# EAGLE design tetris (EAGLE 6.2)
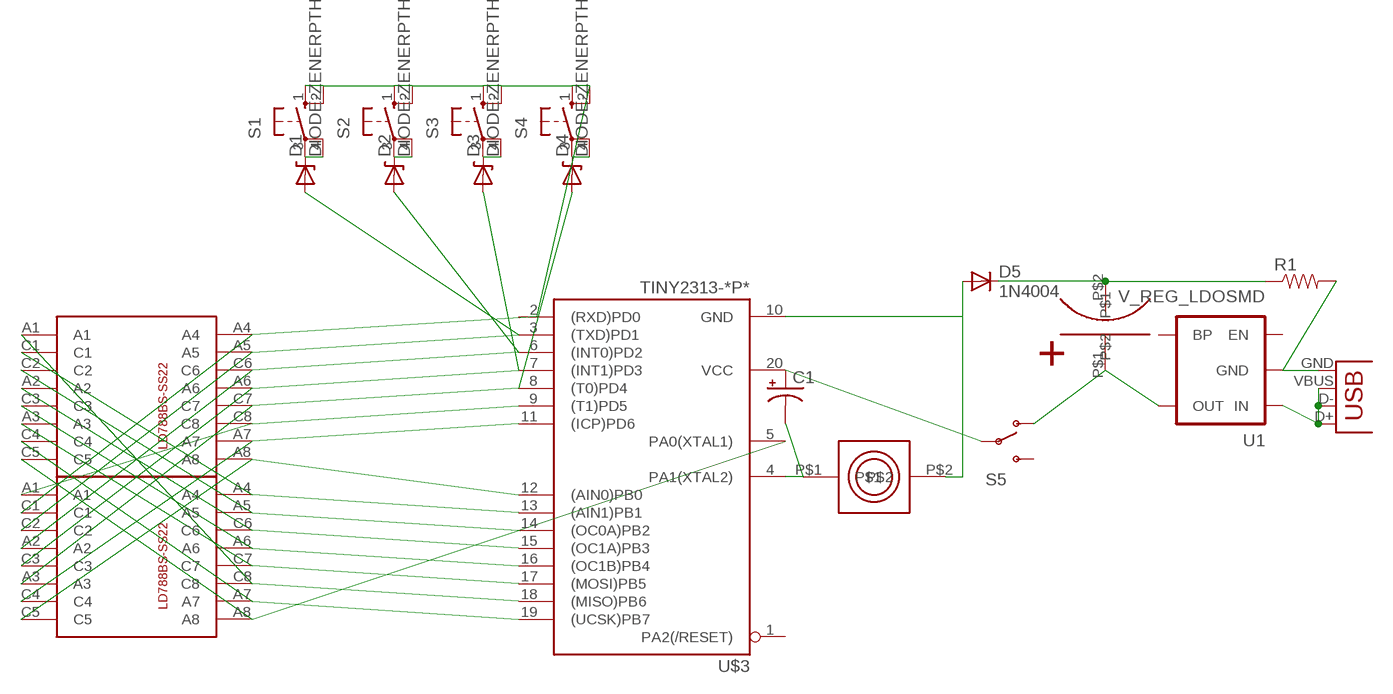
[diagram p0: schematic, sheet 1]

## Parts
C1  CAP_POLPTH1  [CPOL-RADIAL-100UF-25V]
D1  DIODE-ZENERPTH  [DIODE-ZENER]
D2  DIODE-ZENERPTH  [DIODE-ZENER]
D3  DIODE-ZENERPTH  [DIODE-ZENER]
D4  DIODE-ZENERPTH  [DIODE-ZENER]
D5  1N4004  [DO41-10]
R1  RESISTORPTH1  [AXIAL-0.3]
S1  10-XX  [B3F-10XX]
S2  10-XX  [B3F-10XX]
S3  10-XX  [B3F-10XX]
S4  10-XX  [B3F-10XX]
S5  SWITCH-SPSTSMD2  [SWITCH-SPDT-SMD]
U1  V_REG_LDOSMD  [SOT23-5]
U$1  LD788BS-SS22  [LD788BS-SS22]
U$2  LD788BS-SS22  [LD788BS-SS22]
U$3  TINY2313-*P*  [DIL20]
U$4  I-80450RF  [ISK4.1K_I-80450RF_I2G]
U$5  NICHICON_12F  [NICHICON_10X30]
X1  USB-MICROB  [USB-MICROB]

## Nets
N$1: U$1.A4 U$2.C1 U$3.13((AIN1)PB1)
N$2: U$1.A5 U$2.C2 U$3.14((OC0A)PB2)
N$3: U$1.C6 U$2.A2 U$3.15((OC1A)PB3)
N$4: U$1.A6 U$2.C3 U$3.16((OC1B)PB4)
N$5: U$1.C7 U$2.A3 U$3.17((MOSI)PB5)
N$6: U$1.A7 U$2.C4 U$3.19((UCSK)PB7)
N$7: U$1.A8 U$2.C5 U$3.5(PA0(XTAL1))
N$8: U$1.C8 U$2.A1 U$3.18((MISO)PB6)
N$9: D5.C R1.P$1 U$5.P$2
N$10: D1.P$2(A) U$1.C2 U$2.A5 U$3.3((TXD)PD1)
N$11: D2.P$2(A) U$1.A2 U$2.C6 U$3.6((INT0)PD2)
N$12: D3.P$2(A) U$1.C3 U$2.A6 U$3.7((INT1)PD3)
N$13: D4.P$2(A) U$1.A3 U$2.C7 U$3.8((T0)PD4)
N$14: U$1.A1 U$2.C8 U$3.9((T1)PD5)
N$15: U$1.C4 U$2.A7 U$3.11((ICP)PD6)
N$16: U$1.C5 U$2.A8 U$3.12((AIN0)PB0)
N$17: C1.2(-) U$3.4(PA1(XTAL2)) U$4.P$1
N$18: D5.A U$3.10(GND) U$4.P$2
N$19: S5.1(O) U1.5(OUT) U$5.P$1
N$20: D1.P$1(C) S1.3(P) S1.4(P1)
N$21: D2.P$1(C) S2.3(P) S2.4(P1)
N$22: D3.P$1(C) S3.3(P) S3.4(P1)
N$23: D4.P$1(C) S4.3(P) S4.4(P1)
N$24: R1.P$2 U1.2(GND) X1.GND
N$25: U1.1(IN) X1.D+ X1.D- X1.VBUS
N$26: C1.1(+) S5.2(P) U$3.20(VCC)
N$27: S1.1(S) S1.2(S1) S2.1(S) S2.2(S1) S3.1(S) S3.2(S1) S4.1(S) S4.2(S1) U$1.C1 U$2.A4
Unconnected: S5.3(S) U1.3(EN) U1.4(BP) U$3.1(PA2(/RESET)) U$3.2((RXD)PD0)

## Library data of the parts
C1 = SparkFun:CAP_POL: Capacitor Polarized These are standard SMD and PTH capacitors. Normally 10uF, 47uF, and 100uF in electrolytic and tantalum varieties. Always verify the external diameter of the through hole cap, it varies with capacity, voltage, and manufacturer. The EIA devices should be standard.
D1-D4 = SparkFun:DIODE-ZENER: Zener Diode Production Part - 8199 3.4V Zener Voltage
D5 = adafruit:1N4004: DIODE General purpose 1N400x type rectifier (With bigger pads) http://www.ladyada.net/library/pcb/eaglelibrary.html
R1 = SparkFun:RESISTOR: Resistor Basic schematic elements and footprints for 0603, 1206, and PTH 1/10th watt (small) resistors.
S1-S4 = switch-omron:10-XX: OMRON SWITCH; MPN: B3F-1000; OC_FARNELL: 176432; OC_NEWARK: 36M3542
S5 = SparkFun:SWITCH-SPST: SPST Switch Simple slide switch. Spark Fun Electronics SKU : COM-00102
U1 = SparkFun:V_REG_LDO: Voltage Regulator LDO Standard 150mA LDO voltage regulator in SOT-23 layout. Micrel part MIC5205. BP (by-pass) pin is used to lower output noise with 470pF cap.
U$1 U$2 = mrule:LD788BS-SS22
U$3 = avr-6:TINY2313*: Atmel Tiny2313 2K Flash, 128 bytes EEPROM, 128 bytes RAM
U$4 = mrule:I-80450RF
U$5 = mrule:NICHICON_12F
X1 = SparkFun:USB: USB Connectors USB-B-PTH is fully proven SKU : PRT-00139 USB-miniB is fully proven SKU : PRT-00587 USB-A-PCB is untested. USB-A-H is throughly reviewed, but untested. Spark Fun Electronics SKU : PRT-00437 USB-B-SMT is throughly reviewed, but untested. Needs silkscreen touching up. USB-A-S has not been used/tested USB-MB-H has not been used/tested

## Board
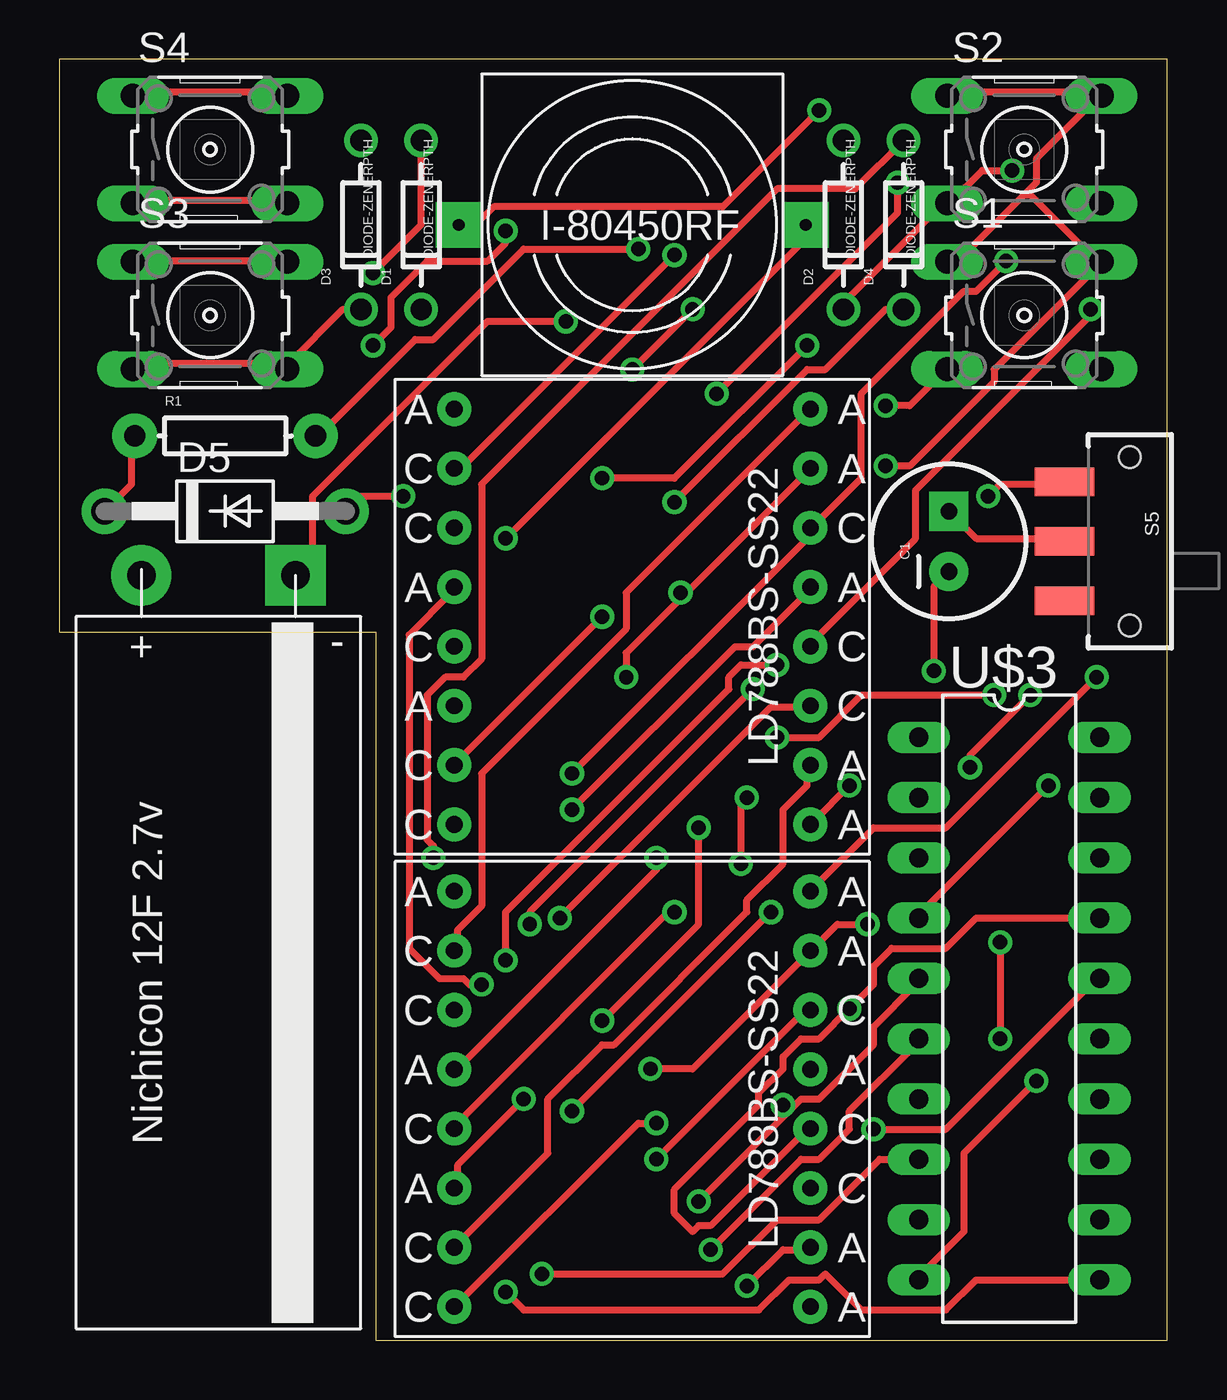
[diagram p1: board, top side]
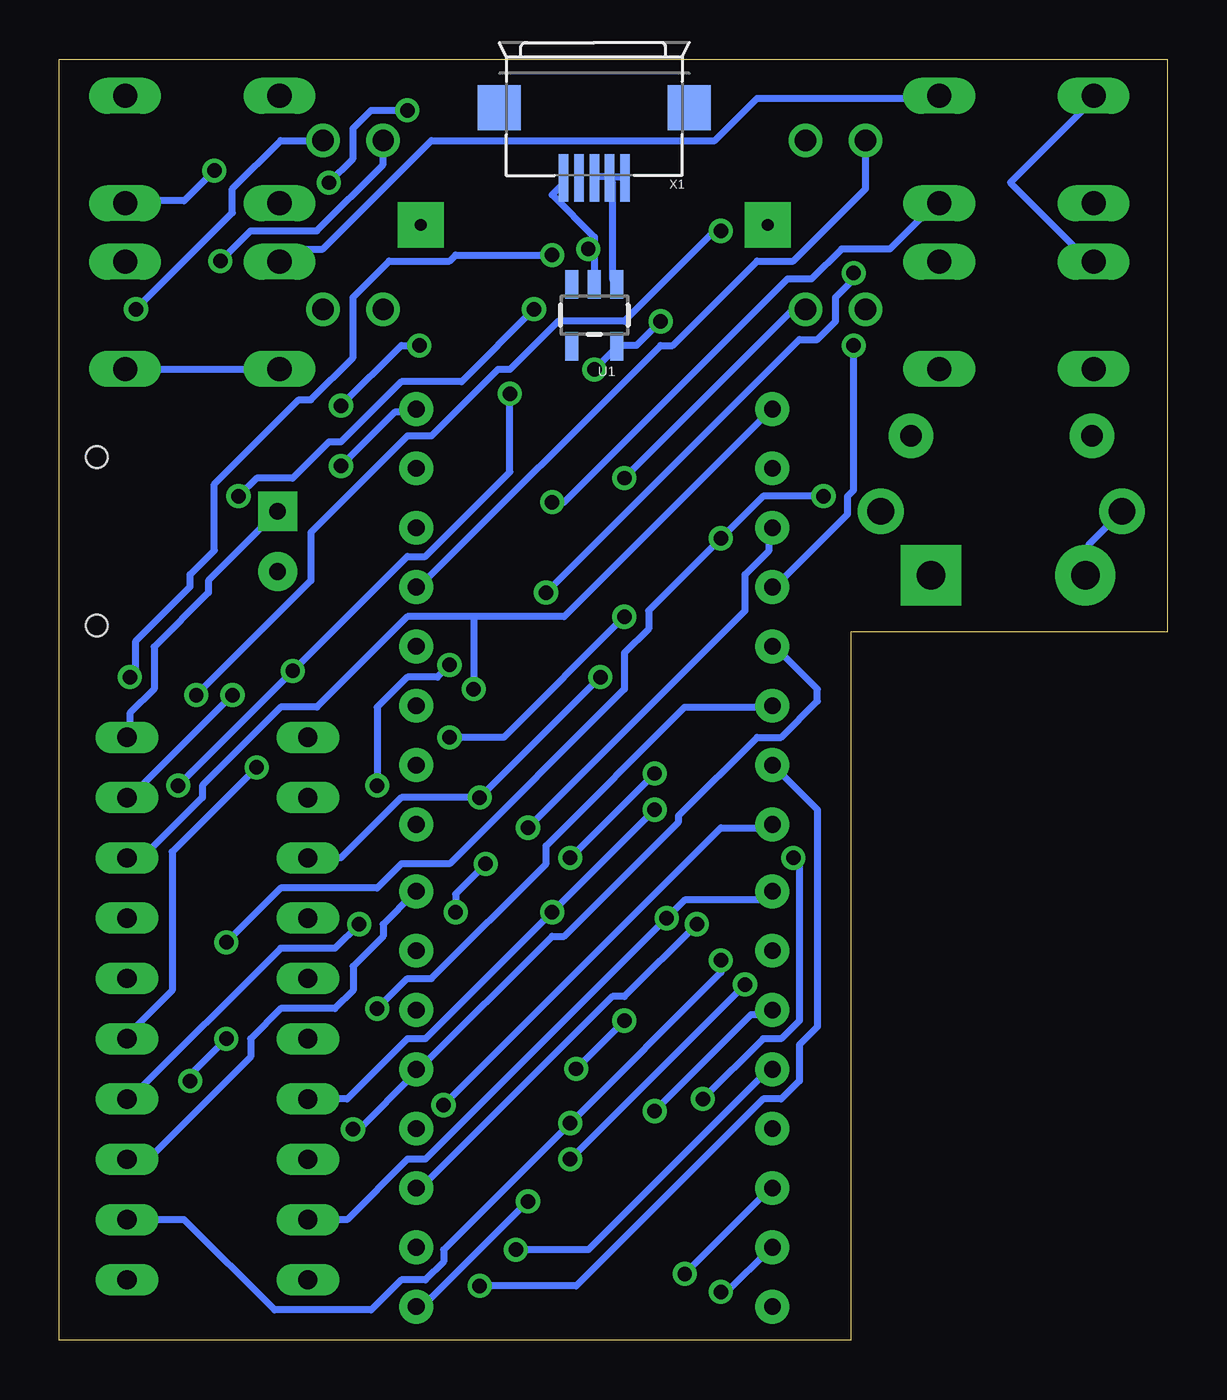
[diagram p2: board, bottom side, seen from below]

Size 46.66 x 53.97 mm. Coordinates in mm from the lower left corner, seen from the top.
Outline: 0,29.84 13.34,29.84 13.34,0 46.66,0 46.66,53.97 0,53.97 0,29.84
Copper layers (1*16): Top 0.035mm / dielectric 1.5mm / Bottom 0.035mm
Design rules: minimum track width 12mil, minimum drill 24mil, track to track 10mil, track to pad 10mil, pad to pad 10mil, via to via 10mil, smd to smd 8mil, copper to edge 40mil, drill to drill 8mil, minimum pad ring 10mil, minimum via ring 8mil, stop-mask expansion 4mil, vias tented up to drill 0mil, thermal gap 10mil

### Footprints (pad centres in the part's own frame; a part is rotated, then mirrored left to right if it is on the bottom)
CPOL-RADIAL-100UF-25V = drill 0.7 pad 1.651 square: 1 1.27,0 | drill 0.7 pad 1.651: 2 -1.27,0
DIODE-ZENER = drill 0.9: P$1 -3.556,0; P$2 3.556,0
DO41-10 = drill 1.118 pad 1.93: A 5.08,0; C -5.08,0
AXIAL-0.3 = drill 0.9 pad 1.88: P$1 -3.81,0; P$2 3.81,0
B3F-10XX = drill 1.016 long: 1 -3.251,2.261; 2 3.251,2.261; 3 -3.251,-2.261; 4 3.251,-2.261
SWITCH-SPDT-SMD = smd 1.2 x 2.5: 1 -2.5,-2.75; 2 0,-2.75; 3 2.5,-2.75 | hole 0.9: -3.55,0; 3.55,0
SOT23-5 = smd 0.55 x 1.2: 1 -0.95,-1.3; 2 0,-1.3; 3 0.95,-1.3; 4 0.95,1.3; 5 -0.95,1.3
LD788BS-SS22 = drill 0.7 pad 1.422: A1 -7.5,8.75; A2 -7.5,1.25; A3 -7.5,-3.75; A4 7.5,8.75; A5 7.5,6.25; A6 7.5,1.25; A7 7.5,-6.25; A8 7.5,-8.75; C1 -7.5,6.25; C2 -7.5,3.75; C3 -7.5,-1.25; C4 -7.5,-6.25; C5 -7.5,-8.75; C6 7.5,3.75; C7 7.5,-1.25; C8 7.5,-3.75
DIL20 = drill 0.813 long: 1 -11.43,-3.81; 2 -8.89,-3.81; 3 -6.35,-3.81; 4 -3.81,-3.81; 5 -1.27,-3.81; 6 1.27,-3.81; 7 3.81,-3.81; 8 6.35,-3.81; 9 8.89,-3.81; 10 11.43,-3.81; 11 11.43,3.81; 12 8.89,3.81; 13 6.35,3.81; 14 3.81,3.81; 15 1.27,3.81; 16 -1.27,3.81; 17 -3.81,3.81; 18 -6.35,3.81; 19 -8.89,3.81; 20 -11.43,3.81
ISK4.1K_I-80450RF_I2G = drill 0.5 pad 1.93 square: P$1 -7.303,0; P$2 7.303,0
NICHICON_10X30 = drill 1.2 pad 2.54 square: P$1 2.75,-1.75 | drill 1.2 pad 2.54: P$2 9.25,-1.75
USB-MICROB = smd 0.4 x 2: D+ 0,3.1; D- -0.65,3.1; GND 1.3,3.1; ID 0.65,3.1; VBUS -1.3,3.1 | smd 1.8 x 1.9: GND@2 -4,0.15; GND@3 4,0.15

### Placement (x,y rotation side)
C1  37.47,33.66 90 top
D1  15.24,46.99 90 top
D2  33.02,46.99 90 top
D3  12.7,46.99 90 top
D4  35.56,46.99 90 top
D5  6.99,34.92 0 top
R1  6.99,38.1 0 top
S1  40.64,43.18 0 top
S2  40.64,50.16 0 top
S3  6.35,43.18 0 top
S4  6.35,50.16 0 top
S5  45.09,33.66 270 top
U1  24.13,43.18 180 bottom
U$1  24.13,10.16 0 top
U$2  24.13,30.48 0 top
U$3  40.01,13.97 270 top
U$4  24.13,46.99 0 top
U$5  12.7,30.48 180 top
X1  24.13,52.07 180 bottom

### Tracks (layer width: path | path; a pad name or v marks a point on that pad's centre or on a via)
N$1  (via drill 0.61)
  Top 0.305: v25.91,45.72 17.02,36.83 16.76,36.83 U$2.C1 | v43.69,27.94 37.34,21.59 34.29,21.59 31.75,19.05 U$1.A4
  Bottom 0.305: U$3.13 42.93,7.62 38.61,11.94 38.61,12.7 37.34,13.97 35.05,13.97 34.29,14.73 34.29,15.75 33.02,17.02 33.02,17.53 31.75,18.8 U$1.A4 | v25.91,45.72 29.97,45.72 30.23,45.47 32.77,45.47 34.29,43.94 34.29,41.4 36.07,39.62 36.58,39.62 40.13,36.07 40.13,33.27 41.15,32.26 41.15,31.75 43.43,29.46 43.43,28.19 v43.69,27.94
N$2  (via drill 0.61)
  Top 0.305: v34.04,17.53 32.77,17.53 31.75,16.51 U$1.A5 31.5,16.26 26.67,11.43 v24.89,11.43 | v26.92,21.59 26.92,17.53 v22.86,13.46
  Bottom 0.305: v34.04,17.53 35.05,16.51 37.34,16.51 43.69,10.16 U$3.14 | v26.92,21.59 17.78,30.73 17.78,32.26 16.76,33.27 16.76,34.04 U$2.C2 | v24.89,11.43 v22.86,13.46
N$3  (via drill 0.61)
  Top 0.305: v38.35,24.13 38.35,24.64 v40.89,27.18 | v18.8,46.74 18.8,46.23 18.03,45.47 15.49,45.47 13.97,43.94 13.97,42.67 v13.21,41.91 | v25.15,7.62 31.24,13.72 31.5,13.72 U$1.C6 | v17.78,14.99 17.27,14.99 17.02,15.24 16,15.24 14.73,16.51 14.73,29.72 16.51,31.5 U$2.A2
  Bottom 0.305: v38.35,24.13 41.91,20.57 41.91,14.73 43.69,12.95 43.69,12.7 U$3.15 | v40.89,27.18 36.07,32 36.07,34.04 32,38.1 30.99,38.1 28.19,40.89 27.69,40.89 25.65,42.93 22.86,42.93 19.05,46.74 v18.8,46.74 | v13.21,41.91 13.21,35.81 13.46,35.56 13.46,34.8 16.51,31.75 U$2.A2 | v17.78,14.99 v25.15,7.62
N$4  (via drill 0.61)
  Top 0.305: v34.29,8.89 37.34,8.89 43.69,15.24 U$3.16
  Bottom 0.305: v34.29,8.89 34.04,8.89 31.75,11.18 U$1.A6 31.5,11.43 25.91,17.02 25.4,17.02 20.57,21.84 20.57,22.1 17.27,25.4 16.26,25.4 14.73,26.92 14.73,27.43 16.51,29.21 U$2.C3
N$5  (via drill 0.61)
  Top 0.305: U$3.17 38.61,17.78 37.34,16.51 35.05,16.51 34.29,15.75 34.29,14.99 v33.27,13.97 32,12.7 31.24,12.7 30.48,11.94 30.48,11.43 29.46,10.41 29.46,9.91 25.91,6.35 25.91,5.33 26.67,4.57 26.92,4.83 27.43,4.83 31.5,8.89 U$1.C7
  Bottom 0.305: v33.27,13.97 32,15.24 30.99,15.24 26.16,20.07 26.16,20.83 20.32,26.67 16.76,26.67 U$2.A3
N$6  (via drill 0.61)
  Top 0.305: v39.37,27.18 33.78,27.18 32,25.4 v30.23,25.4 | v22.86,30.48 16.76,24.38 U$2.C4 | v28.96,2.29 30.48,3.81 31.5,3.81 U$1.A7
  Bottom 0.305: v39.37,27.18 43.69,22.86 U$3.19 | v30.23,25.4 27.94,25.4 v22.86,30.48 | v28.96,2.29 24.89,2.29 17.02,10.16 16.26,10.16 15.49,10.92 15.49,12.45 14.73,13.21 14.73,22.35 16.51,24.13 U$2.C4
N$7  (via drill 0.61)
  Top 0.305: v26.92,5.84 30.73,9.65 | 30.73,9.65 31.24,10.16 32,10.16 34.29,12.45 34.29,13.21 36.07,14.99 36.07,15.24 U$3.5 | 30.73,9.65 v30.48,9.91
  Bottom 0.305: v26.92,5.84 31.5,1.27 U$1.A8 | v30.48,9.91 18.8,21.59 16.76,21.59 U$2.C5
N$8  (via drill 0.61)
  Top 0.305: v19.81,17.53 19.81,18.03 v29.21,27.43
  Bottom 0.305: U$3.18 43.18,20.32 40.64,22.86 40.64,23.37 37.34,26.67 35.81,26.67 32,30.48 29.21,30.48 | 29.21,30.48 25.4,30.48 16.76,39.12 U$2.A1 | v19.81,17.53 22.86,14.48 23.37,14.48 31.24,6.6 31.5,6.6 U$1.C8 | 29.21,30.48 v29.21,27.43
N$9
  Top 0.305: D5.C 3.05,36.07 3.05,38.1 R1.P$1
  Bottom 0.305: D5.C 3.3,33.53 3.3,32.26 U$5.P$2
N$10  (via drill 0.61)
  Top 0.305: v23.88,27.94 23.88,28.96 26.42,31.5 | 26.42,31.5 31.5,36.58 U$2.A5 | D1.P$2 15.24,46.99 v13.21,44.96 | 26.42,31.5 v26.16,31.5 | v29.97,18.03 v21.59,9.65 | v28.7,20.07 28.7,22.61 v28.96,22.86
  Bottom 0.305: U$3.3 34.8,20.32 32.26,22.86 v28.96,22.86 v23.88,27.94 | v13.21,44.96 13.21,44.7 13.97,43.94 13.97,42.93 14.73,42.16 15.49,42.16 v26.16,31.5 | v21.59,9.65 17.53,13.72 16.76,13.72 U$1.C2 | v29.97,18.03 29.97,18.8 v28.7,20.07
N$11  (via drill 0.61)
  Top 0.305: v39.88,45.47 38.61,44.2 38.1,44.2 33.78,39.88 33.78,36.32 31.75,34.29 U$2.C6 31.5,34.04 31.5,33.78 v21.59,23.88 | v27.43,3.81 31.24,7.62 32,7.62 33.27,8.89 33.27,9.65 36.07,12.45 36.07,12.7 U$3.6 | v25.15,20.32 25.15,19.81 16.76,11.43 U$1.A2
  Bottom 0.305: D2.P$2 33.02,49.53 35.81,46.74 38.61,46.74 v39.88,45.47 | v27.43,3.81 24.38,3.81 16.76,11.43 U$1.A2 | v25.15,20.32 v21.59,23.88
N$12  (via drill 0.61)
  Top 0.305: v25.91,18.03 25.65,18.03 16.76,9.14 U$1.C3 | v21.59,22.35 28.45,29.21 29.21,29.21 31.5,31.5 U$2.A6
  Bottom 0.305: U$3.7 34.54,10.16 32,12.7 31.24,12.7 v25.91,18.03 v21.59,22.35 | D3.P$2 12.7,48.51 15.75,45.47 17.27,45.47 20.83,41.91 21.34,41.91 31.5,31.75 U$2.A6
N$13  (via drill 0.61)
  Top 0.305: U$3.8 34.54,7.62 32,5.08 30.23,5.08 27.94,2.79 v20.32,2.79 | v43.43,43.43 43.43,43.18 36.07,35.81 36.07,33.78 31.75,29.46 U$2.C7 | v19.56,10.16 16.76,7.37 16.76,6.6 U$1.A3 | v15.75,20.32 15.75,20.83 15.49,21.08 15.49,27.18 16.26,27.94 17.02,27.94 17.78,28.7 17.78,36.07 30.23,48.51 33.53,48.51 D4.P$2
  Bottom 0.305: v20.32,2.79 16.76,6.35 U$1.A3 | D4.P$2 37.34,50.55 39.37,48.51 39.37,47.5 v43.43,43.43 | v19.56,10.16 17.02,12.7 16.26,12.7 15.49,13.46 15.49,20.07 v15.75,20.32
N$14  (via drill 0.61)
  Top 0.305: v21.08,17.78 29.97,26.67 31.5,26.67 U$2.C8
  Bottom 0.305: U$3.9 34.54,5.08 32,7.62 31.24,7.62 v21.08,17.78 20.32,18.54 17.02,18.54 16.76,18.8 U$1.A1
N$15  (via drill 0.61)
  Top 0.305: U$3.11 38.61,2.54 37.34,1.27 33.78,1.27 32.26,2.79 32,2.54 30.73,2.54 29.46,1.27 19.56,1.27 v18.8,2.03 | U$2.A7 31.5,24.13 31.5,23.37 30.48,22.35 30.48,20.07 28.96,18.54 28.96,18.03 23.37,12.45 22.86,12.45 20.57,10.16 20.57,7.87 16.76,4.06 U$1.C4
  Bottom 0.305: v18.8,2.03 18.54,2.03 16.76,3.81 U$1.C4
N$16  (via drill 0.61)
  Top 0.305: v25.15,9.14 24.38,9.14 16.76,1.52 U$1.C5 | v33.27,23.37 31.75,21.84 U$2.A8 | v30.23,28.45 28.7,28.45 28.19,27.94 28.19,27.43 18.8,18.03 v18.8,16
  Bottom 0.305: U$3.12 41.4,5.08 37.59,1.27 33.53,1.27 32.26,2.54 31.24,2.54 30.48,3.3 30.48,3.81 v25.15,9.14 18.8,15.49 v18.8,16 | v33.27,23.37 33.27,26.67 32,27.94 30.73,27.94 v30.23,28.45
N$17  (via drill 0.61)
  Top 0.305: v41.66,23.37 36.32,18.03 36.32,17.78 U$3.4 | v36.83,28.19 36.83,31.75 C1.2 | U$4.P$1 17.53,46.99 18.29,47.75 27.94,47.75 v32,51.82 | v35.31,48.77 35.31,47.5 v27.69,39.88
  Bottom 0.305: v41.66,23.37 v36.83,28.19 32,33.02 31.24,33.02 27.69,36.58 v27.69,39.88 | v32,51.82 33.53,51.82 34.29,51.05 34.29,49.78 v35.31,48.77
N$18  (via drill 0.61)
  Top 0.305: v41.15,10.92 38.1,7.87 38.1,4.57 36.32,2.79 36.32,2.54 U$3.10 | v39.62,16.76 v39.62,12.7 | v14.48,35.56 12.7,35.56 D5.A | v18.8,33.78 31.24,46.23 31.24,46.99 U$4.P$2
  Bottom 0.305: v41.15,10.92 41.15,11.18 v39.62,12.7 | v39.62,16.76 37.34,19.05 33.27,19.05 32.26,20.07 30.23,20.07 22.86,27.43 22.86,28.96 21.84,29.97 21.84,30.73 v18.8,33.78 17.02,35.56 v14.48,35.56
N$19  (via drill 0.61)
  Top 0.305: v21.34,42.93 18.03,42.93 10.67,35.56 10.67,32.77 10.16,32.26 U$5.P$1 | v39.12,35.56 39.62,36.07 42.16,36.07 S5.1 | v24.13,40.89 v26.67,43.43
  Bottom 0.305: v21.34,42.93 22.35,41.91 23.11,41.91 U1.5 23.37,41.66 v24.13,40.89 | v39.12,35.56 38.35,36.32 36.83,36.32 35.31,37.85 34.8,37.85 32.26,40.39 29.72,40.39 v26.67,43.43
N$20  (via drill 0.61)
  Top 0.305: v22.86,36.32 25.91,36.32 v31.5,41.91 | v34.8,39.37 35.81,39.37 37.34,40.89 S1.3
  Bottom 0.305: D1.P$1 15.75,43.43 v22.86,36.32 | v31.5,41.91 32.26,41.91 v34.8,39.37 | S1.4 43.69,40.89 37.59,40.89 S1.3
N$21  (via drill 0.61)
  Top 0.305: D2.P$1 33.02,43.69 37.34,48.01 S2.3 37.59,48.01 38.86,49.28 v40.13,49.28
  Bottom 0.305: v40.13,49.28 41.4,48.01 43.69,48.01 S2.4
N$22
  Top 0.305: D3.P$1 11.94,43.43 9.65,41.15 S3.4 9.4,41.15 3.3,41.15 S3.3
N$23  (via drill 0.61)
  Top 0.305: D4.P$1 34.8,43.43 32.26,40.89 31.5,40.89 v25.91,35.31 | S4.3 3.3,48.01 9.4,48.01 S4.4
  Bottom 0.305: v25.91,35.31 25.4,35.31 16,44.7 14.99,44.7 13.72,45.97 11.68,45.97 9.65,48.01 S4.4
N$24  (via drill 0.61)
  Top 0.305: v24.38,45.97 19.56,45.97 15.75,42.16 14.99,42.16 10.92,38.1 R1.P$2
  Bottom 0.305: 24.13,45.97 24.13,46.48 25.91,48.26 25.4,48.77 X1.GND | 24.13,45.97 U1.2 | v24.38,45.97 24.13,45.97
N$25
  Bottom 0.305: U1.1 23.37,44.7 23.37,48.77 X1.D- | X1.VBUS 22.86,49.02 23.37,49.02 X1.D- | X1.D+ 24.13,49.02 23.62,49.02 X1.D-
N$26
  Top 0.305: C1.1 38.61,33.78 42.16,33.78 S5.2
  Bottom 0.305: C1.1 40.39,32 40.39,31.5 42.67,29.21 42.67,27.43 43.69,26.42 43.69,25.4 U$3.20
N$27  (via drill 0.61)
  Top 0.305: U$1.C1 16.76,16.51 16.76,17.27 17.78,18.29 17.78,23.88 23.88,29.97 23.88,31.5 31.5,39.12 U$2.A4 | S3.1 3.3,45.47 9.4,45.47 S3.2 | S4.1 3.3,52.58 9.4,52.58 S4.2 | 40.64,48.26 41.15,48.77 41.15,49.78 43.69,52.32 S2.2 43.69,52.58 37.59,52.58 S2.1 | 40.64,48.26 37.85,45.47 37.59,45.47 S1.1 | 40.64,48.26 40.89,48.26 43.69,45.47 S1.2 43.69,45.21 39.37,40.89 39.37,40.39 35.81,36.83 v34.8,36.83
  Bottom 0.305: S3.1 3.3,45.47 6.6,48.77 3.05,52.32 S4.1 | S4.2 9.65,52.32 17.27,52.32 19.05,50.55 30.99,50.55 35.56,45.97 36.83,45.97 37.34,45.47 S1.1 | v34.8,36.83 32.51,39.12 31.75,39.12 U$2.A4